# Altium schematic sheet power.SchDoc
size A4
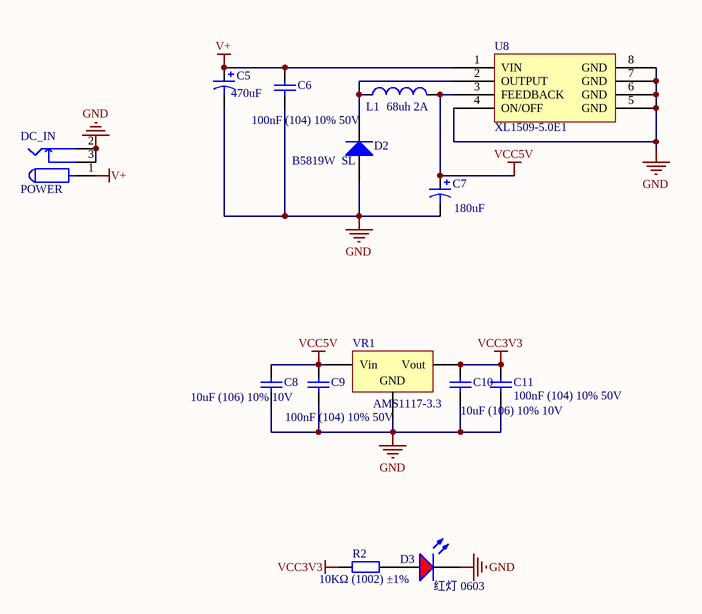
[diagram p0: power.SchDoc]

## Parts
C5  value 470uF  [SMD-EC-F8]  (hidden comment: Cap Pol3)
C6  100nF (104) 10% 50V  [0603_C]
C7  value 180uF  [470UF_A]  (hidden comment: Cap Pol3)
C8  10uF (106) 10% 10V  [0603_C]
C9  100nF (104) 10% 50V  [0603_C]
C10  10uF (106) 10% 10V  [0603_C]
C11  100nF (104) 10% 50V  [0603_C]
D2  B5819W  SL  [SOD-123]
D3  红灯 0603  [0603_LED_S1]
DC_IN  POWER  [DC10B]
L1  68uh 2A  [0630]
R2  10KΩ (1002) ±1%  [0603_R]
U8  XL1509-5.0E1  [SOP-8_150mil]
VR1  AMS1117-3.3  [SOT-223]

## Nets
GND: C5.2 C6.1 C7.2 C8.1 C9.1 C10.1 C11.1 D2.1(A) D3.K DC_IN.2 DC_IN.3 U8.4(ON/OFF) U8.5(GND) U8.6(GND) U8.7(GND) U8.8(GND) VR1.1(GND)
V+: C5.1 C6.2 DC_IN.1 U8.1(VIN)
VCC3V3: C10.2 C11.2 R2.1 VR1.2(Vout)
VCC5V: C7.1 C8.2 C9.2 L1.2 U8.3(FEEDBACK) VR1.3(Vin)
NetD2_2: D2.2(K) L1.1 U8.2(OUTPUT)
NetD3_A: D3.A R2.2

## Library data of the parts
C5 C7 = Cap Pol3: Polarized Capacitor (Surface Mount); Published: 8-Jun-2000; LatestRevisionDate: 29-May-2009; LatestRevisionNote: IPC-7351 Footprint Added.; PackageReference: C0805; Publisher: Altium Limited; PackageDescription: Chip Capacitor
C6 C9 C11 = 0603 100nF (104) 10% 50V: 贴片电容; ComponentLink1Description: 供应商链接; ComponentLink1URL: http://www.szlcsc.com/product/details_15331.html; Package: 0603; Supplier: LC; SuppliersPartNumber: C14663
C8 C10 = 0603 10uF (106) 10% 10V: 贴片电容; ComponentLink1Description: 供应商链接; ComponentLink1URL: http://www.szlcsc.com/product/details_20411.html; Package: 0603; Supplier: LC; SuppliersPartNumber: C19702
D2 = SOD-123 B5819W  SL: 肖特基二极管; ComponentLink1Description: 供应商链接; ComponentLink1URL: http://www.szlcsc.com/product/details_9093.html; Package: SOD-123; Supplier: LC; SuppliersPartNumber: C8598
D3 = 0603 红灯: 发光二极管; ComponentLink1Description: 供应商链接; ComponentLink1URL: http://www.szlcsc.com/product/details_2659.html; Package: 0603; Supplier: LC; SuppliersPartNumber: C2286
DC_IN = POW
L1 = Inductor: Code_IEC: 1005; Published: 8-Jun-2000; LatestRevisionDate: 17-Jul-2002; LatestRevisionNote: Re-released for DXP Platform.; PackageReference: 0402-A; Publisher: Altium Limited; Code_JEITA: 0402; Value: 68uh
R2 = 0603 10KΩ (1002) 1%: 贴片电阻; ComponentLink1Description: 供应商链接; ComponentLink1URL: http://www.szlcsc.com/product/details_26547.html; Package: 0603; Supplier: LC; SuppliersPartNumber: C25804
U8 = XL1509-5.0E1_[C61063]: DC-DC芯片; ComponentLink1Description: 供应商链接; ComponentLink1URL: http://www.szlcsc.com/product/details_62115.html; Package: SOP-8_150mil; Supplier: LC; SuppliersPartNumber: C61063
VR1 = SOT-223 AMS1117-3.3: 低压差线性稳压(LDO); ComponentLink1Description: 供应商链接; ComponentLink1URL: http://www.szlcsc.com/product/details_6652.html; Package: SOT-223; Supplier: LC; SuppliersPartNumber: C6186